# Altium schematic sheet power_input.SchDoc: Hall / Main Board / Power supply IN
size A4; DocumentNumber: 5; SheetNumber: 5; SheetTotal: 7
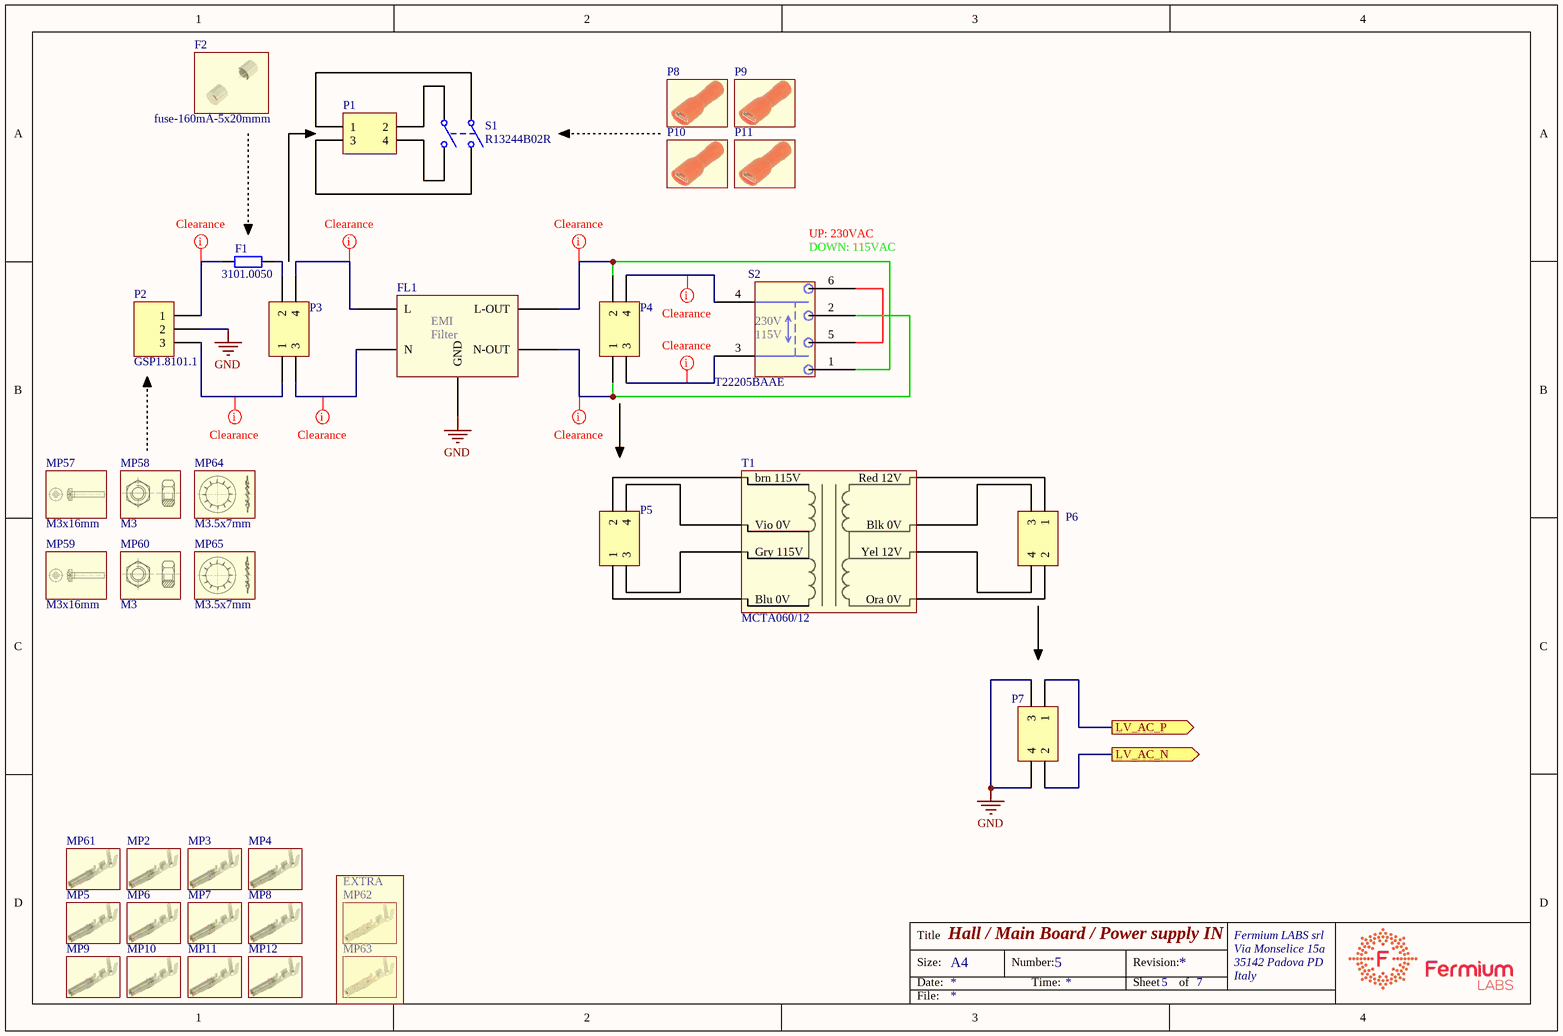
[diagram p0: power_input.SchDoc]

## Parts
F1  Supplier Part Number 1: 3101.0050  [FPG5-3101-0050]
F2  fuse-160mA-5x20mmm  (mechanical)
FL1  (no value)  [FM412-2]
MP2  (no value)  (mechanical)
MP3  (no value)  (mechanical)
MP4  (no value)  (mechanical)
MP5  (no value)  (mechanical)
MP6  (no value)  (mechanical)
MP7  (no value)  (mechanical)
MP8  (no value)  (mechanical)
MP9  (no value)  (mechanical)
MP10  (no value)  (mechanical)
MP11  (no value)  (mechanical)
MP12  (no value)  (mechanical)
MP57  Size: M3x16mm  (hidden comment: screw-M3x25mm)  (mechanical)
MP58  Size: M3  (hidden comment: nut-M3)  (mechanical)
MP59  Size: M3x16mm  (hidden comment: screw-M3x25mm)  (mechanical)
MP60  Size: M3  (hidden comment: nut-M3)  (mechanical)
MP61  (no value)  (mechanical)
MP62  (no value)  (mechanical)
MP63  (no value)  (mechanical)
MP64  Size: M3.5x7mm  (hidden comment: rondella-dentata-m3.5_1)  (mechanical)
MP65  Size: M3.5x7mm  (hidden comment: rondella-dentata-m3.5_1)  (mechanical)
P1  (no value)  (mechanical)
P2  Supplier Part Number 1: GSP1.8101.1  [gsp1-8101-1]
P3  (no value)  [molex-039281043]
P4  (no value)  [molex-039281043]
P5  (no value)  (mechanical)
P6  (no value)  (mechanical)
P7  (no value)  [molex-039281043]
P8  faston-4.5-f-red  (value not drawn)  (mechanical)
P9  faston-4.5-f-red  (value not drawn)  (mechanical)
P10  faston-4.5-f-red  (value not drawn)  (mechanical)
P11  faston-4.5-f-red  (value not drawn)  (mechanical)
S1  Supplier Part Number 1: R13244B02R  [rocker-switch]  (mechanical)
S2  (no value)  [T22205B]
T1  Manufacturer Part Number: MCTA060/12  [MCTA060]  (hidden comment: toroidal_transformer)

## Blocks framed on the sheet
EXTRA: MP62 MP63

## Ports
LV_AC_N (out), LV_AC_P (out)

## Nets
GND: FL1.3(GND) P2.2 P7.3 P7.4
LV_AC_N: P7.2 ; port LV_AC_N
LV_AC_P: P7.1 ; port LV_AC_P
NetF1_1: F1.1 P2.1
NetF1_2: F1.2 P3.2
NetFL1_1: FL1.1(N) P3.3
NetFL1_2: FL1.2(N-OUT) P4.1 S2.2
NetFL1_4: FL1.4(L-OUT) P4.2 S2.1
NetFL1_5: FL1.5(L) P3.4
NetP2_3: P2.3 P3.1
NetP4_3: P4.3 S2.3
NetP4_4: P4.4 S2.4
NetS2_5: S2.5 S2.6

Not connected (* = marked no-connect by the designer): P1 1 2 3 4; P5 1 2 3 4; P6 1 2 3 4; S1 1(COMMON1) 2(NO1) 3(COMMON2) 4(NO2); T1 1(brn_115V) 2(Vio_0V) 3(Gry_115V) 4(Blu_0V) 5(Ora_0V) 6(Yel_12V) 7(Blk_0V) 8(Red_12V)

## Layout directives
rule Clearance Constraint [Clearance = 78.74mil]: NetF1_1, NetFL1_1, NetFL1_2, NetFL1_4, NetFL1_5, NetP2_3, NetP4_3, NetP4_4

## Notes on the sheet
- (near S2) UP: 230VAC
- (near S2) DOWN: 115VAC
- Title
- Size:
- Date:
- A4
- Number:
- Time:
- Revision:
- Sheet
- of
- Fermium LABS srl
- Via Monselice 15a
- 35142 Padova PD
- Italy
- File:
- (in symbol emi_filter) EMI; Filter
- (in symbol t22205b) 230V; 115V; T22205BAAE

## Library data of the parts
F1 = Res2: fuse holder; Manufacturer: SCHURTER; Manufacturer series: FPG5; Unit: pcs; SuppliedAmount: 0; MinAmount: 1; Fuses application: tube fuses; Fuse size: 5x20mm; Maximum current: 10A; Body material: thermoplastic; Colour: black; Rated voltage: 250V AC; Contact resistance: 5mΩ; Mounting hole diameter: Ø12.5mm; Pads: 3 THT; Supplier 1: TME; Manufacturer Part Number: 3101.0050; Category: Fuses - PCB Fuseholders; Stock 1: 748; Pricing 1: 1=1.3262, 5=1.2056, 20=1.0248, 50=0.9042, 100=0.7837 (EUR); Weight: 5.157; Multiples: 1; Fuse accessories type: fuse holder; Mounting: PCB; Operating temperature: -40...85°C; Flammability rating: UL94V-0; Contact plating: tinned; Contact material: copper; Price Type: NET; ComponentLink1URL: http://static.tme.eu/products_pics/c/7/b/c7be9a841de84195debe9c2bc5e13201/378039.jpg; ComponentLink1Description: http://static.tme.eu/products_pics/c/7/b/c7be9a841de84195debe9c2bc5e13201/378039.jpg
F2 = fuse-160mA-5x20mmm: Manufacturer Part Number: 522.509; Manufacturer: ESKA; Supplier 1: TME; Supplier Part Number 1: ZKT-0.16A
FL1 = emi_filter: Manufacturer: FILTERCON; Manufacturer Part Number: FM414-2; Unit: pcs; SuppliedAmount: 0; MinAmount: 1; Filter type: anti-interference; Operating voltage: 250V AC; Capacitance Cx: 100nF; Capacitance Cy: 2.2nF; Inductance of individual winding: 2mH; Operating current max.: 2A; Enclosure material: metal; Pads: 5 THT; Supplier 1: TME; Supplier Part Number 1: FM414-2; Category: THT Suppression Filters; Stock 1: 0; Pricing 1: 1=2.68, 5=2.45, 10=2.02 (EUR); Weight: 12.938; Multiples: 1; Mounting: THT; Price Type: NET; ComponentLink1URL: http://static.tme.eu/products_pics/2/9/f/29f0a38a703704a9c5886b8224f607ef/346186.jpg; ComponentLink1Description: http://static.tme.eu/products_pics/2/9/f/29f0a38a703704a9c5886b8224f607ef/346186.jpg; Supplier 2: TME; Supplier Part Number 2: 1FM415-0R; Stock 2: 25; Pricing 2: 1=3.58, 5=3.13, 10=2.68 (EUR); ComponentLink2URL: http://static.tme.eu/products_pics/f/8/b/f8b7aa3a0d349d9562b424160ad18612/6719.jpg; ComponentLink2Description: http://static.tme.eu/products_pics/f/8/b/f8b7aa3a0d349d9562b424160ad18612/6719.jpg; Supplier 3: TME; Supplier Part Number 3: FM415-0; Stock 3: 14; Pricing 3: 1=2.45, 5=2.25, 10=1.89, 50=1.84, 200=1.81 (EUR); ComponentLink3URL: http://static.tme.eu/products_pics/3/4/2/3420617ffe855077c7443b070bb0da97/359972.jpg; ComponentLink3Description: http://static.tme.eu/products_pics/3/4/2/3420617ffe855077c7443b070bb0da97/359972.jpg; Supplier 4: TME; Supplier Part Number 4: FM411-4; Stock 4: 1; Pricing 4: 1=3.13, 5=2.9, 10=2.45 (EUR); ComponentLink4URL: http://static.tme.eu/products_pics/8/c/6/8c6609017eb196817ebf7bb4af7e52b0/22859.jpg; ComponentLink4Description: http://static.tme.eu/products_pics/8/c/6/8c6609017eb196817ebf7bb4af7e52b0/22859.jpg; Supplier 5: TME; Supplier Part Number 5: 1FM411-4R; Stock 5: 0; Pricing 5: 1=3.58, 5=3.13, 10=2.68 (EUR); ComponentLink5URL: http://static.tme.eu/products_pics/3/1/9/3198dfd0aef271d22f7bcddd6f12f5cb/6717.jpg; ComponentLink5Description: http://static.tme.eu/products_pics/3/1/9/3198dfd0aef271d22f7bcddd6f12f5cb/6717.jpg
MP2-MP12 MP61-MP63 = molex-039000060: Manufacturer: Molex; Manufacturer Part Number: 039000060; Supplier 1: TME; Supplier Part Number 1: MX-39-00-0060
MP57 MP59 = screw-M3x25mm: Manufacturer Part Number: M3X16/D7985; Manufacturer: KRAFTBERG; Supplier 1: TME; Supplier Part Number 1: M3X16/D7985
MP58 MP60 = nut-M3: Manufacturer Part Number: 1874659; Manufacturer: BOSSARD; Supplier 1: TME; Supplier Part Number 1: B3/BN117
MP64 MP65 = rondella-dentata-m3.5_1: Manufacturer Part Number: M3.5/BN782 DIN6798J; Manufacturer: BOSSARD; Supplier 1: TME; Supplier Part Number 1: B3.5/BN782
P1 P5 P6 = Header 2X2: connector 4 pin wire; Manufacturer Part Number: 039012040; Manufacturer: Molex; Pads: 4 THT; Supplier 1: TME; Supplier Part Number 1: MX-5557-04R
P2 = Header 3: IEC pcb AC power socket; Manufacturer: SCHURTER; Unit: pcs; SuppliedAmount: 0; MinAmount: 1; Connector type: AC supply; Connector variant: C14 (E); Mechanical mounting: on PCBs; Rated current: 10A; Rated voltage: 250V AC; Thread: M3; Leads: 4.8x0.8mm connectors; Mounting hole diameter: 30.3 x 22.5mm; Mounting holes pitch: 40mm; Panel thickness: max 3mm; Pads: 3 THT; LatestRevisionDate: 17-Jul-2002; LatestRevisionNote: Re-released for DXP Platform.; Publisher: Altium Limited; Supplier 1: TME; Manufacturer Part Number: GSP1.8101.1; Category: AC power connectors; Stock 1: 292; Pricing 1: 1=0.97, 5=0.92, 10=0.87, 20=0.82, 100=0.72 (EUR); Weight: 13.947; Multiples: 1; Standard: IEC 60320; Connector: socket; Operating temperature: -25...70°C; Price Type: NET; ComponentLink1URL: http://static.tme.eu/products_pics/f/d/c/fdcf8bc89f97dfd93b47315e6a3722d1/329145.jpg; ComponentLink1Description: http://static.tme.eu/products_pics/f/d/c/fdcf8bc89f97dfd93b47315e6a3722d1/329145.jpg
P3 = Header 2X2: Connector 4 wire pcb; Manufacturer Part Number: 039281043; Manufacturer: Molex; Pads: 2 THT; Supplier Part Number 1: MX-5566-04A; Supplier 1: TME
P4 P7 = Header 2X2: Connector 4 wire pcb; Manufacturer Part Number: 039281043; Manufacturer: Molex; Pads: 4 THT; Supplier Part Number 1: MX-5566-04A; Supplier 1: TME
P8-P11 = faston-4.5-f-red: Manufacturer Part Number: BM 00192; Manufacturer: BM GROUP; Supplier 1: TME; Supplier Part Number 1: BM00192
S1 = SW-DPST: Double-Pole, Single-Throw Switch; Manufacturer: SCI; Manufacturer Part Number: R13-244B-02-BR-2D; Unit: pcs; SuppliedAmount: 0; MinAmount: 1; Switch type: ROCKER; Stable positions number: 2-position; Contacts configuration: DPST; Switching method: OFF-ON; AC contacts rating: 10 A / 250 VAC; Key button colour: red; Illumination: neon lamp 230V; Max. contact resistance:: 50mΩ; Body colour: black; Leads: 4.8x0.8mm connectors; Panel thickness: max 3mm; Mounting hole diameter: Ø20.2mm; Number of positions: 2; Button marking: --O; Body material: polyamide; Associated items: R13-112-12; Published: 24-Mar-1999; LatestRevisionDate: 17-Jul-2002; LatestRevisionNote: Re-released for DXP Platform.; PackageReference: DPST-4; Publisher: Altium Limited; PackageDescription: Switch; 4 Leads; Supplier 1: TME; Category: Rocker Switches; Stock 1: 764; Pricing 1: 1=1.55, 5=1.39, 20=1.27, 100=1.14, 500=1.02 (EUR); Weight: 6.43; Multiples: 1; Flammability rating: UL94V-2; Operating temperature: -20...85°C; Backlight colour: red; Price Type: NET; ComponentLink1URL: http://static.tme.eu/products_pics/d/a/1/da1c318484d667a913e20f7b696bdf34/232407.jpg; ComponentLink1Description: http://static.tme.eu/products_pics/d/a/1/da1c318484d667a913e20f7b696bdf34/232407.jpg
S2 = t22205b: Switch DPDT 230-115V; Supplier 1: TME; Supplier Part Number 1: AE-T22205B
T1 = toroidal_transformer: Manufacturer: MULTICOMP; Livello di Potenza: 60; Tensioni Secondarie: 2 x 12; Corrente Nom Secondario: 2.5; Montaggio Trasformatore: Pannello; Gamma Prodotti: MCTA Series; Sostanze Estremamente Preoccupanti (SVHC): No SVHC (20-Jun-2016); Diametro Esterno: 91.5; Lunghezza/Altezza Esterna: 39; Potenza Secondario: 30VA<!--FANDB--><div class="features-and-benefits-container"><div class="features-and-benefits-description"><span class="features-benefits-value">The Multicomp MCTA series are general purpose toroidal transformers with flying leads. They feature dual primary and dual secondary windings.</span></div><div class="features-and-benefits-list"><ul class="features-and-benefits-list-list"><li class="features-and-benefits-list-item">Power rating ranges from 15VA to 1000VA</li><li class="features-and-benefits-list-item">Secondary voltages ranges from 2 x 6VAC to 2 x 55VAC</li><li class="features-and-benefits-list-item">Dual primary winding for connection in series or parallel only</li><li class="features-and-benefits-list-item">Secondary windings can be connected in series or parallel or used independently</li><li class="features-and-benefits-list-item">Double insulated primary lead-out</li><li class="features-and-benefits-list-item">Flexible lead-out can be trimmed to any length without the need for removal of enamel</li><li class="features-and-benefits-list-item">100% electrical and flash tested</li></ul></div><div class="features-and-benefits-contents"><span class="features-and-benefits-value">Transformer, Dished mounting plate, 2 foam pads, Screw, Nut and Washer.</span></div><div class="features-and-benefits-applications"><ul class="features-and-benefits-value"><li class="features-and-benefits-list-item">Industriale</li><li class="features-and-benefits-list-item">Gestione Alimentazione </li></ul></div></div>; Supplier 1: Farnell; Supplier Part Number 1: 9530428; RoHS: YES; Stock 1: 111; Pricing 1: 1=13.68, 5=12.94, 20=12.17, 60=11.86, 200=11.55 (EUR); Livello di Corrente: 2.5; ComponentLink1URL: http://www.farnell.com/cad/1906782.pdf; ComponentLink1Description: http://www.farnell.com/cad/1906782.pdf; ComponentLink2URL: http://www.farnell.com/datasheets/1829278.pdf; ComponentLink2Description: http://www.farnell.com/datasheets/1829278.pdf